# EAGLE design New_Multirotor_CPU_imu (EAGLE 6.3)
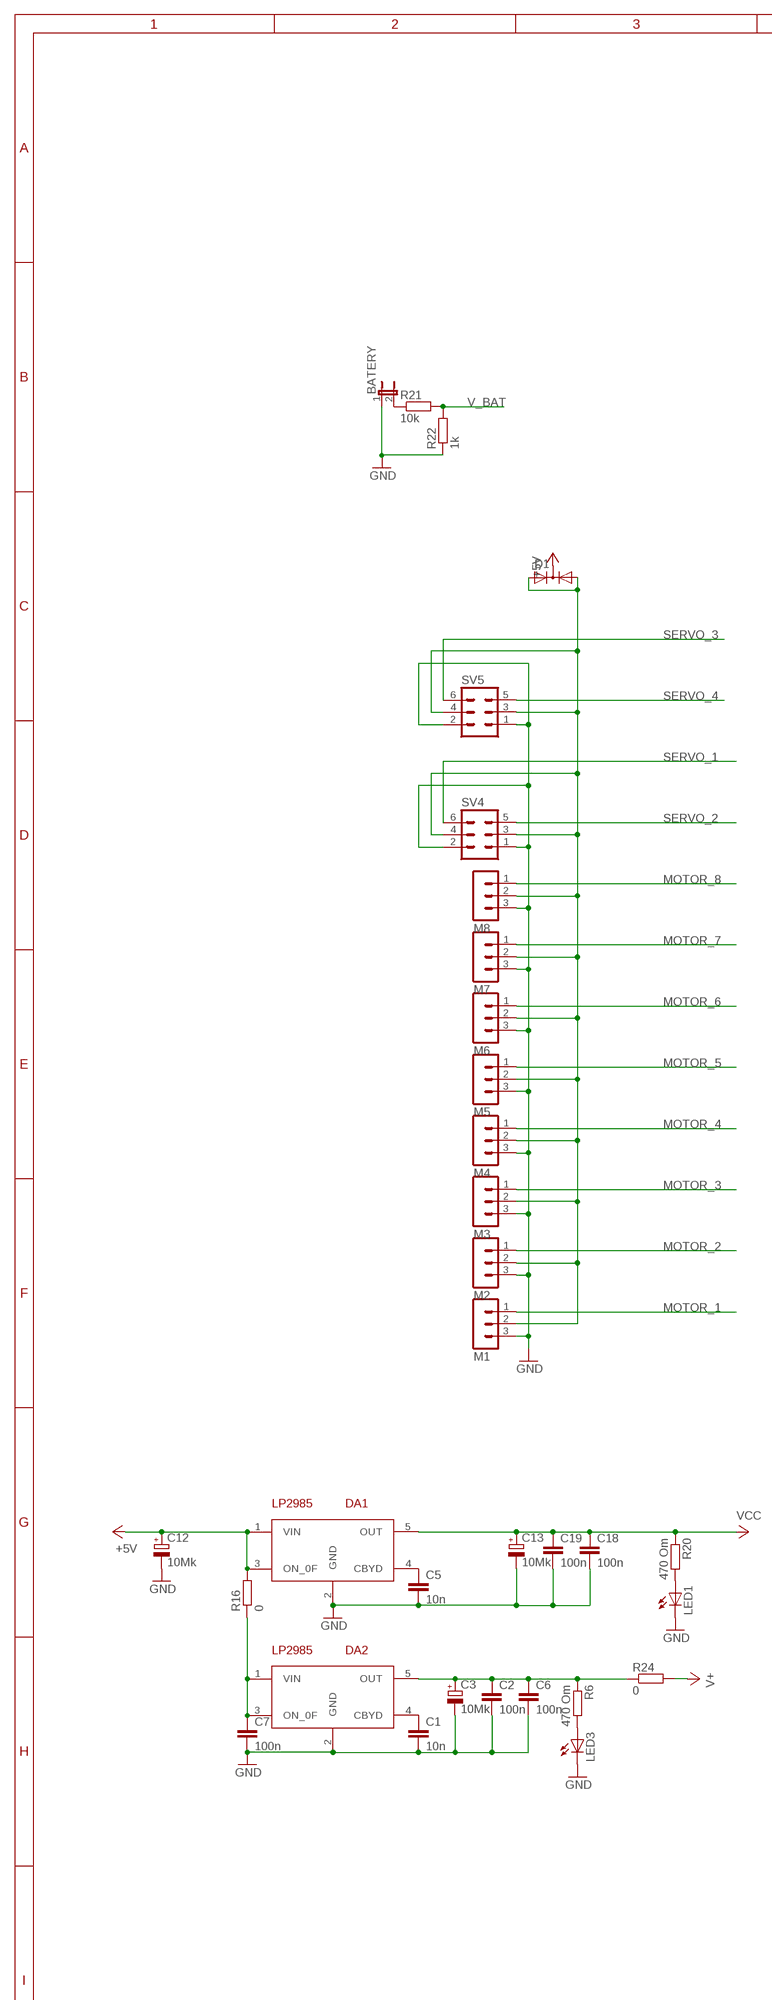
[diagram p0: schematic, sheet 1, part 1 of 2]
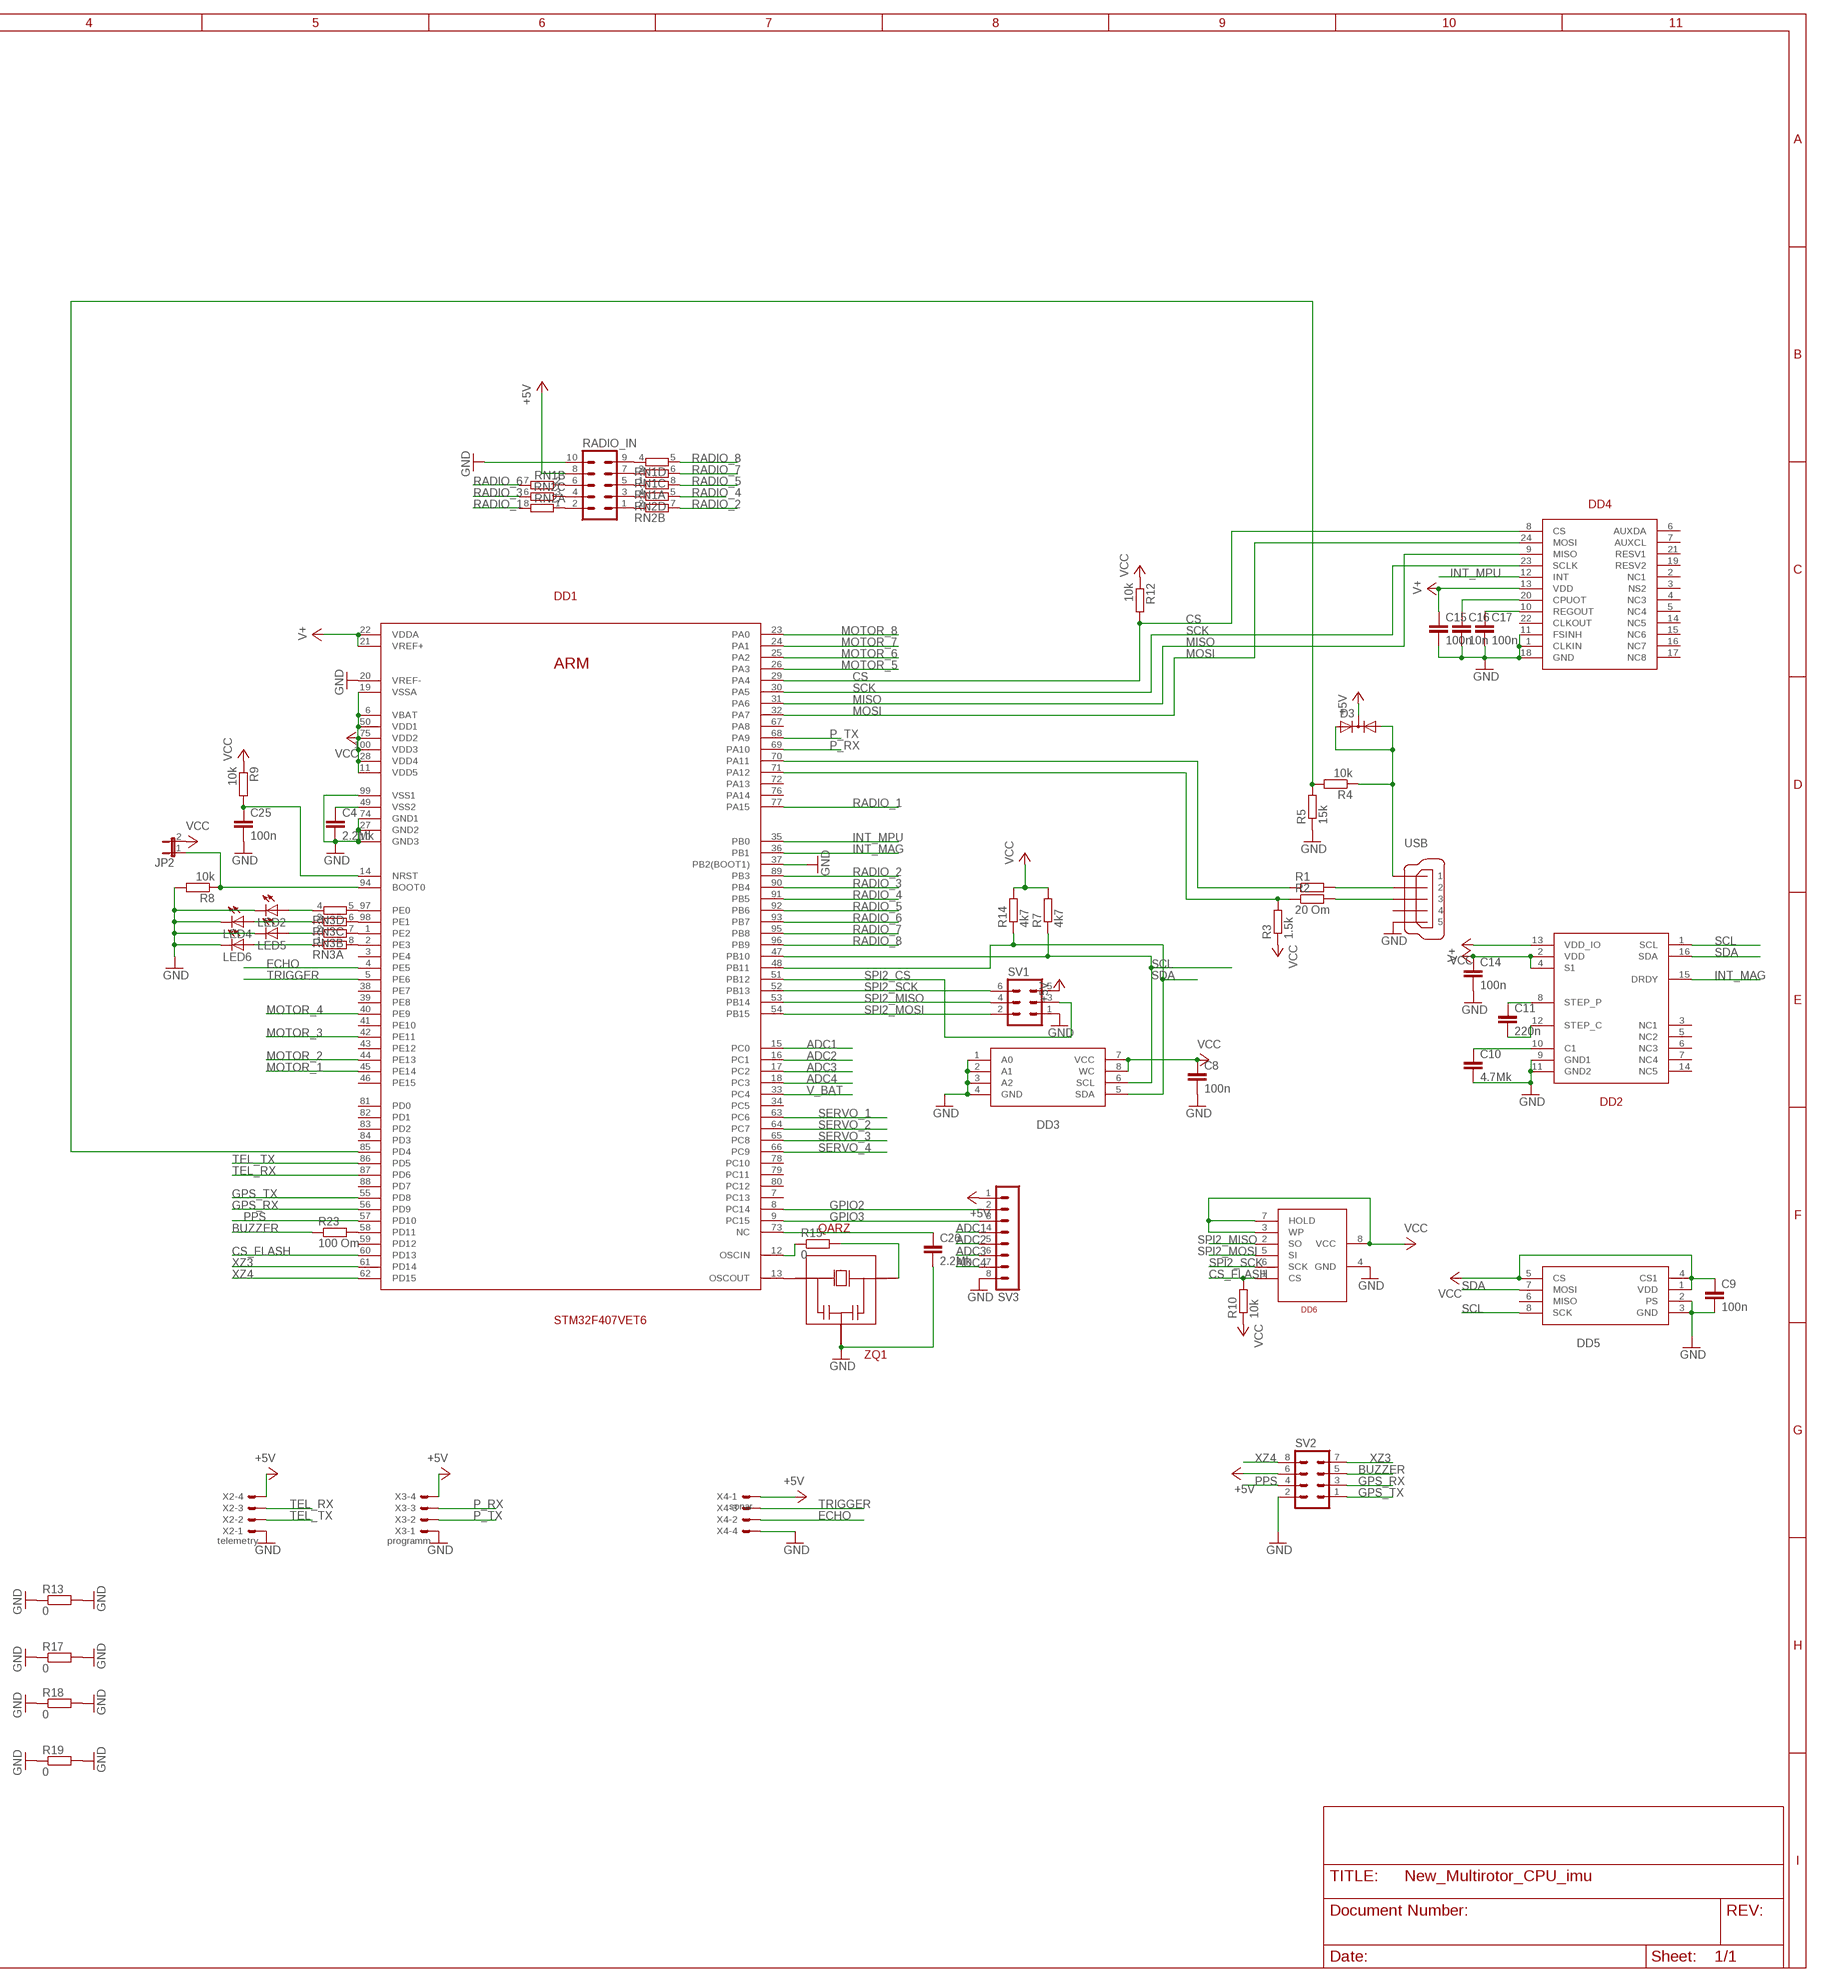
[diagram p1: schematic, sheet 1, part 2 of 2]

## Parts
BATERY  JP1E  [JP1]
C1  10n  C-EUC0603K  [C0603K]
C2  100n  C-EUC0603K  [C0603K]
C3  10Mk  CPOL-EUA/3216-18W  [A/3216-18W]
C4  2.2Mk  C-EUC0603K  [C0603K]
C5  10n  C-EUC0603K  [C0603K]
C6  100n  C-EUC0603K  [C0603K]
C7  100n  C-EUC0603K  [C0603K]
C8  100n  C-EUC0603K  [C0603K]
C9  100n  C-EUC0603K  [C0603K]
C10  4.7Mk  C-EUC0603K  [C0603K]
C11  220n  C-EUC0603K  [C0603K]
C12  10Mk  CPOL-EUA/3216-18W  [A/3216-18W]
C13  10Mk  CPOL-EUA/3216-18W  [A/3216-18W]
C14  100n  C-EUC0603K  [C0603K]
C15  100n  C-EUC0603K  [C0603K]
C16  10n  C-EUC0603K  [C0603K]
C17  100n  C-EUC0603K  [C0603K]
C18  100n  C-EUC0603K  [C0603K]
C19  100n  C-EUC0603K  [C0603K]
C25  100n  C-EUC0603K  [C0603K]
C26  2.2Mk  C-EUC0603K  [C0603K]
D1  DIODE-2AC|CASOT23  [SOT23]
D3  DIODE-2AC|CASOT23  [SOT23]
DA1  LP2985  3.3  [SOT23-5L]
DA2  LP2985  3.3  [SOT23-5L]
DD1  STM32F407VET6  [LQFP100]
DD2  HMC5883L  [LCC-16]
DD3  24C512  [SOIC8]
DD4  MPU6000  [JEDEC]
DD5  MS5611-01BA03  [MS5611-01BA03]
DD6  W25X40  [SOIC8]
JP2  JP1E  [JP1]
LED1  LEDCHIPLED_0603  [CHIPLED_0603]
LED2  LEDCHIPLED_0603  [CHIPLED_0603]
LED3  LEDCHIPLED_0603  [CHIPLED_0603]
LED4  LEDCHIPLED_0603  [CHIPLED_0603]
LED5  LEDCHIPLED_0603  [CHIPLED_0603]
LED6  LEDCHIPLED_0603  [CHIPLED_0603]
M1  MA03-1  [MA03-1]
M2  MA03-1  [MA03-1]
M3  MA03-1  [MA03-1]
M4  MA03-1  [MA03-1]
M5  MA03-1  [MA03-1]
M6  MA03-1  [MA03-1]
M7  MA03-1  [MA03-1]
M8  MA03-1  [MA03-1]
R1  R-EU_R0603  [R0603]
R2  20 Om  R-EU_R0603  [R0603]
R3  1.5k  R-EU_R0603  [R0603]
R4  10k  R-EU_R0603  [R0603]
R5  15k  R-EU_R0603  [R0603]
R6  470 Om  R-EU_R0603  [R0603]
R7  4k7  R-EU_R0603  [R0603]
R8  10k  R-EU_R0603  [R0603]
R9  10k  R-EU_R0603  [R0603]
R10  10k  R-EU_R0603  [R0603]
R12  10k  R-EU_R0603  [R0603]
R13  0  R-EU_R0603  [R0603]
R14  4k7  R-EU_R0603  [R0603]
R15  0  R-EU_R0603  [R0603]
R16  0  R-EU_R0603  [R0603]
R17  0  R-EU_R0603  [R0603]
R18  0  R-EU_R0603  [R0603]
R19  0  R-EU_R0603  [R0603]
R20  470 Om  R-EU_R0603  [R0603]
R21  10k  R-EU_R0603  [R0603]
R22  1k  R-EU_R0603  [R0603]
R23  100 Om  R-EU_R0603  [R0603]
R24  0  R-EU_R0603  [R0603]
RADIO_IN  MA05-2  [MA05-2]
RN1  4R-N0603-ARV  [0603-ARV]
RN2  4R-N0603-ARV  [0603-ARV]
RN3  4R-N0603-ARV  [0603-ARV]
SV1  MA03-2  [MA03-2]
SV2  MA04-2  [MA04-2]
SV3  MA08-1  [MA08-1]
SV4  MA03-2  [MA03-2]
SV5  MA03-2  [MA03-2]
USB  MINI-USB-32005-201  [32005-201]
X2  telemetry  SM04B-SRSS-TB  [SM04B-SRSS-TB]
X3  programm  SM04B-SRSS-TB  [SM04B-SRSS-TB]
X4  sonar  SM04B-SRSS-TB  [SM04B-SRSS-TB]
ZQ1  QARZ  [QARZ]

## Nets
+5V: C12.+ D1.3(C) D3.3(C) DA1.1(VIN) DA1.3(ON_0F) R16.2 RADIO_IN.8 SV1.5 SV2.6 SV3.1 X2.4 X3.4 X4.1
ADC1: DD1.15(PC0) SV3.4
ADC2: DD1.16(PC1) SV3.5
ADC3: DD1.17(PC2) SV3.6
ADC4: DD1.18(PC3) SV3.7
BUZZER: R23.1 SV2.5
CS: DD1.29(PA4) DD4.8(CS) R12.2
CS_FLASH: DD1.60(PD13) DD6.1(CS) R10.2
ECHO: DD1.4(PE5) X4.2
GND: BATERY.1 C1.2 C2.2 C3.- C4.2 C5.2 C6.2 C7.2 C8.2 C9.2 C10.2 C12.- C13.- C14.2 C15.2 C16.2 C17.2 C18.2 C19.2 C25.2 C26.2 DA1.2(GND) DA2.2(GND) DD1.10(GND3) DD1.20(VREF-) DD1.27(GND2) DD1.37(PB2(BOOT1)) DD1.74(GND1) DD1.99(VSS1) DD2.9(GND1) DD2.11(GND2) DD3.1(A0) DD3.2(A1) DD3.3(A2) DD3.4(GND) DD4.1(CLKIN) DD4.11(FSINH) DD4.18(GND) DD5.2(PS) DD5.3(GND) DD6.4(GND) LED1.C LED2.C LED3.C LED4.C LED5.C LED6.C M1.3 M2.3 M3.3 M4.3 M5.3 M6.3 M7.3 M8.3 R5.1 R8.2 R13.1 R13.2 R17.1 R17.2 R18.1 R18.2 R19.1 R19.2 R22.1 RADIO_IN.10 SV1.1 SV2.2 SV3.8 SV4.1 SV4.2 SV5.1 SV5.2 USB.5 X2.1 X3.1 X4.4 ZQ1.2
GPIO2: DD1.8(PC14) SV3.2
GPIO3: DD1.9(PC15) SV3.3
GPS_RX: DD1.56(PD9) SV2.3
GPS_TX: DD1.55(PD8) SV2.1
INT_MAG: DD1.36(PB1) DD2.15(DRDY)
INT_MPU: DD1.35(PB0) DD4.12(INT)
MISO: DD1.31(PA6) DD4.9(MISO)
MOSI: DD1.32(PA7) DD4.24(MOSI)
MOTOR_1: DD1.45(PE14) M1.1
MOTOR_2: DD1.44(PE13) M2.1
MOTOR_3: DD1.42(PE11) M3.1
MOTOR_4: DD1.40(PE9) M4.1
MOTOR_5: DD1.26(PA3) M5.1
MOTOR_6: DD1.25(PA2) M6.1
MOTOR_7: DD1.24(PA1) M7.1
MOTOR_8: DD1.23(PA0) M8.1
N$1: DD1.13(OSCOUT) ZQ1.1
N$2: R15.2 ZQ1.3
N$3: DD1.97(PE0) RN3.5
N$4: C1.1 DA2.4(CBYD)
N$5: DD1.98(PE1) RN3.6
N$6: LED3.A R6.2
N$7: C2.1 C3.+ C6.1 DA2.5(OUT) R6.1 R24.1
N$8: RADIO_IN.5 RN1.1
N$9: C7.1 DA2.1(VIN) DA2.3(ON_0F) R16.1
N$10: DD1.1(PE2) RN3.7
N$11: DD1.2(PE3) RN3.8
N$12: DD1.12(OSCIN) R15.1
N$13: LED1.A R20.2
N$16: LED2.A RN3.4
N$17: LED4.A RN3.3
N$19: C16.1 DD4.20(CPUOT)
N$20: D1.1(A1) D1.2(A2) M1.2 M2.2 M3.2 M4.2 M5.2 M6.2 M7.2 M8.2 SV4.3 SV4.4 SV5.3 SV5.4
N$21: RADIO_IN.3 RN2.4
N$22: C17.1 DD4.10(REGOUT)
N$23: RADIO_IN.9 RN1.4
N$24: RADIO_IN.7 RN1.3
N$25: BATERY.2 R21.1
N$26: C10.1 DD2.10(C1)
N$27: C11.2 DD2.12(STEP_C)
N$28: C11.1 DD2.8(STEP_P)
N$29: DD1.58(PD11) R23.2
N$32: RADIO_IN.6 RN1.2
N$33: RADIO_IN.1 RN2.2
N$34: RADIO_IN.4 RN2.3
N$35: RADIO_IN.2 RN2.1
N$38: LED5.A RN3.2
N$39: LED6.A RN3.1
N$41: DD1.70(PA11) R1.1
N$42: DD1.71(PA12) R2.1 R3.2
N$43: R1.2 USB.2
N$44: R2.2 USB.3
N$45: DD1.85(PD4) R4.2 R5.2
N$47: D3.1(A1) D3.2(A2) R4.1 USB.1
N$52: C5.1 DA1.4(CBYD)
N$53: C4.1 DD1.49(VSS2)
N$61: DD1.94(BOOT0) JP2.1 R8.1
N$66: C25.1 DD1.14(NRST) R9.2
N$77: C26.1 DD1.73(NC)
P_RX: DD1.69(PA10) X3.3
P_TX: DD1.68(PA9) X3.2
PPS: DD1.57(PD10) SV2.4
RADIO_1: DD1.77(PA15) RN2.8
RADIO_2: DD1.89(PB3) RN2.7
RADIO_3: DD1.90(PB4) RN2.6
RADIO_4: DD1.91(PB5) RN2.5
RADIO_5: DD1.92(PB6) RN1.8
RADIO_6: DD1.93(PB7) RN1.7
RADIO_7: DD1.95(PB8) RN1.6
RADIO_8: DD1.96(PB9) RN1.5
SCK: DD1.30(PA5) DD4.23(SCLK)
SCL: DD1.47(PB10) DD2.1(SCL) DD3.6(SCL) DD5.8(SCK) R7.1
SDA: DD1.48(PB11) DD2.16(SDA) DD3.5(SDA) DD5.7(MOSI) R14.1
SERVO_1: DD1.63(PC6) SV4.6
SERVO_2: DD1.64(PC7) SV4.5
SERVO_3: DD1.65(PC8) SV5.6
SERVO_4: DD1.66(PC9) SV5.5
SPI2_CS: DD1.51(PB12) SV1.3
SPI2_MISO: DD1.53(PB14) DD6.2(SO) SV1.4
SPI2_MOSI: DD1.54(PB15) DD6.5(SI) SV1.2
SPI2_SCK: DD1.52(PB13) DD6.6(SCK) SV1.6
TEL_RX: DD1.87(PD6) X2.3
TEL_TX: DD1.86(PD5) X2.2
TRIGGER: DD1.5(PE6) X4.3
V+: C14.1 C15.1 DD1.21(VREF+) DD1.22(VDDA) DD2.2(VDD) DD2.4(S1) DD4.13(VDD) R24.2
V_BAT: DD1.33(PC4) R21.2 R22.2
VCC: C8.1 C9.1 C13.+ C18.1 C19.1 DA1.5(OUT) DD1.6(VBAT) DD1.11(VDD5) DD1.19(VSSA) DD1.28(VDD4) DD1.50(VDD1) DD1.75(VDD2) DD1.100(VDD3) DD2.13(VDD_IO) DD3.7(VCC) DD3.8(WC) DD5.1(VDD) DD5.4(CS1) DD5.5(CS) DD6.3(WP) DD6.7(HOLD) DD6.8(VCC) JP2.2 R3.1 R7.2 R9.1 R10.1 R12.1 R14.2 R20.1
XZ3: DD1.61(PD14) SV2.7
XZ4: DD1.62(PD15) SV2.8
Unconnected: DD1.3(PE4) DD1.7(PC13) DD1.34(PC5) DD1.38(PE7) DD1.39(PE8) DD1.41(PE10) DD1.43(PE12) DD1.46(PE15) DD1.59(PD12) DD1.67(PA8) DD1.72(PA13) DD1.76(PA14) DD1.78(PC10) DD1.79(PC11) DD1.80(PC12) DD1.81(PD0) DD1.82(PD1) DD1.83(PD2) DD1.84(PD3) DD1.88(PD7) DD2.3(NC1) DD2.5(NC2) DD2.6(NC3) DD2.7(NC4) DD2.14(NC5) DD4.2(NC1) DD4.3(NS2) DD4.4(NC3) DD4.5(NC4) DD4.6(AUXDA) DD4.7(AUXCL) DD4.14(NC5) DD4.15(NC6) DD4.16(NC7) DD4.17(NC8) DD4.19(RESV2) DD4.21(RESV1) DD4.22(CLKOUT) DD5.6(MISO) USB.4

## Library data of the parts
BATERY JP2 = jumper:JP1E: JUMPER
C1 C2 C4-C11 C14-C19 C25 C26 = resistor:C-EU: CAPACITOR, European symbol
C3 C12 C13 = resistor:CPOL-EU: POLARIZED CAPACITOR, European symbol
D1 D3 = diode:DIODE-2AC|CA: Dual DIODE Anode-Cathode|Cathode-Anode
DA1 DA2 = pepelac:3.3
DD1 = pepelac:STM32F407VET6
DD2 = pepelac:HMC5883L
DD3 = pepelac:24C512
DD4 = pepelac:MPU6000
DD5 = pepelac:MS5611-01BA03
DD6 = pepelac:W25X40
LED1-LED6 = led:LED: LED OSRAM: - CHIPLED LG R971, LG N971, LY N971, LG Q971, LY Q971, LO R971, LY R971 LH N974, LH R974 LS Q976, LO Q976, LY Q976 LO Q996 - Hyper CHIPLED LW Q18S LB Q993, LB Q99A, LB R99A - SideLED LS A670, LO A670, LY A670, LG A670, LP A670 LB A673, LV A673, LT A673, LW A673 LH A674 LY A675 LS A676, LA A676, LO A676, LY A676, LW A676 LS A679, LY A679, LG A679 - Hyper Micro SIDELED® LS Y876, LA Y876, LO Y876, LY Y876 LT Y87S - SmartLED LW L88C, LW L88S LB L89C, LB L89S, LG L890 LS L89K, LO L89K, LY L89K LS L896, LA L896, LO L896, LY L896 - TOPLED LS T670, LO T670, LY T670, LG T670, LP T670 LSG T670, LSP T670, LSY T670, LOP T670, LYG T670 LG T671, LOG T671, LSG T671 LB T673, LV T673, LT T673, LW T673 LH T674 LS T676, LA T676, LO T676, LY T676, LB T676, LH T676, LSB T676, LW T676 LB T67C, LV T67C, LT T67C, LS T67K, LO T67K, LY T67K, LW E67C LS E67B, LA E67B, LO E67B, LY E67B, LB E67C, LV E67C, LT E67C LW T67C LS T679, LY T679, LG T679 LS T770, LO T770, LY T770, LG T770, LP T770 LB T773, LV T773, LT T773, LW T773 LH T774 LS E675, LA E675, LY E675, LS T675 LS T776, LA T776, LO T776, LY T776, LB T776 LHGB T686 LT T68C, LB T68C - Hyper Mini TOPLED® LB M676 - Mini TOPLED Santana® LG M470 LS M47K, LO M47K, LY M47K Source: http://www.osram.convergy.de LUXEON: - LUMILED® LXK2-PW12-R00, LXK2-PW12-S00, LXK2-PW14-U00, LXK2-PW14-V00 LXK2-PM12-R00, LXK2-PM12-S00, LXK2-PM14-U00 LXK2-PE12-Q00, LXK2-PE12-R00, LXK2-PE12-S00, LXK2-PE14-T00, LXK2-PE14-U00 LXK2-PB12-K00, LXK2-PB12-L00, LXK2-PB12-M00, LXK2-PB14-N00, LXK2-PB14-P00, LXK2-PB14-Q00 LXK2-PR12-L00, LXK2-PR12-M00, LXK2-PR14-Q00, LXK2-PR14-R00 LXK2-PD12-Q00, LXK2-PD12-R00, LXK2-PD12-S00 LXK2-PH12-R00, LXK2-PH12-S00 LXK2-PL12-P00, LXK2-PL12-Q00, LXK2-PL12-R00 Source: www.luxeon.com KINGBRIGHT: KA-3528ASYC Source: www.kingbright.com
M1-M8 = con-lstb:MA03-1: PIN HEADER; OC_FARNELL: unknown; OC_NEWARK: unknown
R1-R10 R12-R24 = resistor:R-EU_: RESISTOR, European symbol
RADIO_IN = con-lstb:MA05-2: PIN HEADER; OC_FARNELL: unknown; OC_NEWARK: unknown
RN1-RN3 = resistor-dil:4R-N: Array Chip Resistor Source: RS Component / Phycomp; OC_FARNELL: unknown; OC_NEWARK: unknown
SV1 SV4 SV5 = con-lstb:MA03-2: PIN HEADER; OC_FARNELL: unknown; OC_NEWARK: unknown
SV2 = con-lstb:MA04-2: PIN HEADER; OC_FARNELL: unknown; OC_NEWARK: unknown
SV3 = con-lstb:MA08-1: PIN HEADER; OC_FARNELL: unknown; OC_NEWARK: unknown
USB = con-cypressindustries:MINI-USB-: MINI USB-B Conector Source: www.cypressindustries.com; OC_FARNELL: unknown; OC_NEWARK: unknown
X2-X4 = pepelac:?M04B-SRSS-TB: Disconnectable Crimp style connector, 1.0mm pitch 4 contacts
ZQ1 = pepelac:QARZ

## Net classes
0 Def: width 0.406 mm, clearance 0.152 mm

## Board
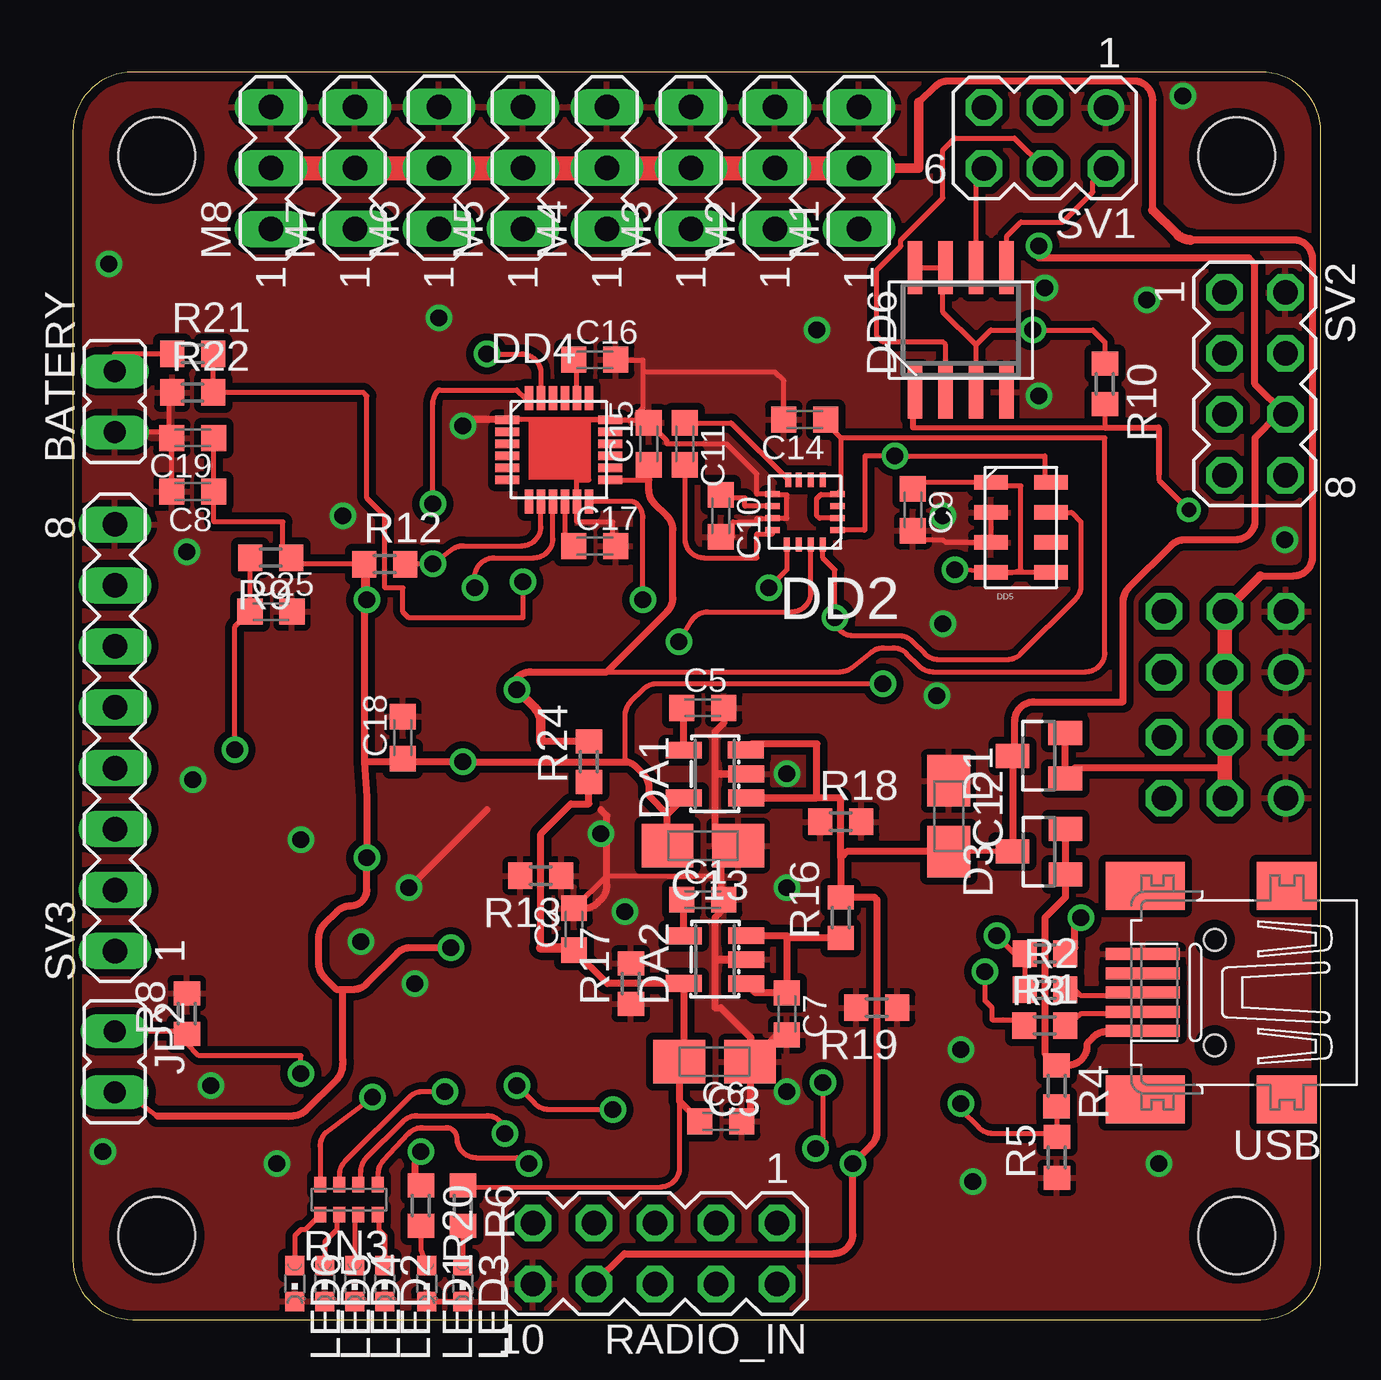
[diagram p2: board, top side]
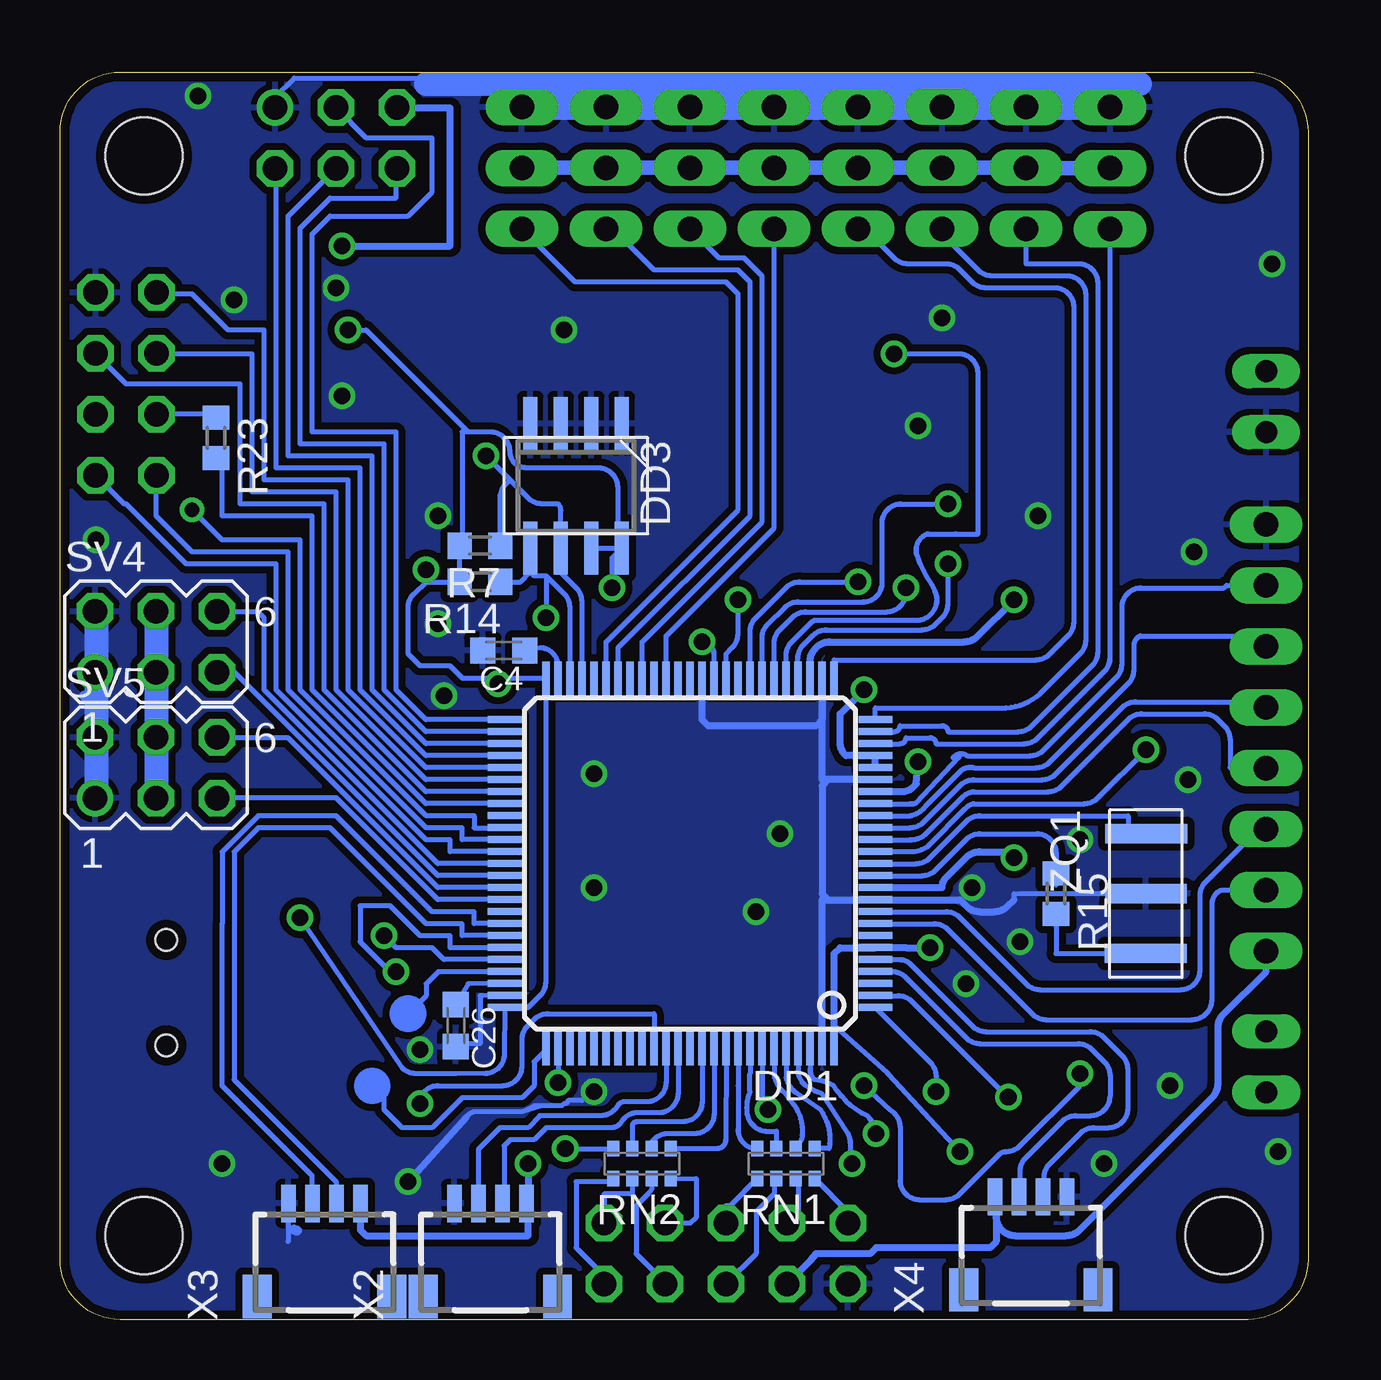
[diagram p3: board, bottom side, seen from below]

Size 52 x 52 mm. Coordinates in mm from the lower left corner, seen from the top.
Outline: 0,49.5 0,2.5 arc90 2.5,0 49.5,0 arc90 52,2.5 52,49.5 arc90 49.5,52 2.5,52 arc90 0,49.5
Copper layers (1*16): Top 0.035mm / dielectric 1.5mm / Bottom 0.035mm
Design rules "default *": minimum track width 10mil, minimum drill 24mil, track to track 8mil, track to pad 8mil, pad to pad 8mil, via to via 8mil, smd to smd 8mil, copper to edge 15mil, drill to drill 8mil, minimum pad ring 10mil, minimum via ring 8mil, stop-mask expansion 4mil, vias tented up to drill 0mil, thermal gap 10mil
Holes 3.2 mm at 3.5,3.5 48.5,3.5 48.5,48.5 3.5,48.5

### Footprints (pad centres in the part's own frame; a part is rotated, then mirrored left to right if it is on the bottom)
JP1 = drill 0.914 long: 1 0,-1.27; 2 0,1.27
C0603K = smd 1.05 x 1.08: 1 -0.875,0; 2 0.875,0
A/3216-18W = smd 2.15 x 1.8: + 1.475,0; - -1.475,0
SOT23 = smd 1 x 1.4: 1 -0.95,-1.1; 2 0.95,-1.1; 3 0,1.1
SOT23-5L = smd 0.7 x 1.5: 1 -1.002,-1.305; 2 0,-1.3; 3 0.997,-1.294; 4 0.991,1.3; 5 -0.998,1.293
LQFP100 = smd 1.4 x 0.3: 1 -7.72,6; 2 -7.72,5.5; 3 -7.72,5; 4 -7.72,4.5; 5 -7.72,4; 6 -7.72,3.5; 7 -7.72,3; 8 -7.72,2.5; 9 -7.72,2; 10 -7.72,1.5; 11 -7.72,1; 12 -7.72,0.5; 13 -7.72,0; 14 -7.72,-0.5; 15 -7.72,-1; 16 -7.72,-1.5; 17 -7.72,-2; 18 -7.72,-2.5; 19 -7.72,-3; 20 -7.72,-3.5; 21 -7.72,-4; 22 -7.72,-4.5; 23 -7.72,-5; 24 -7.72,-5.5; 25 -7.72,-6; 51 7.72,-6; 52 7.72,-5.5; 53 7.72,-5; 54 7.72,-4.5; 55 7.72,-4; 56 7.72,-3.5; 57 7.72,-3; 58 7.72,-2.5; 59 7.72,-2; 60 7.72,-1.5; 61 7.72,-1; 62 7.72,-0.5; 63 7.72,0; 64 7.72,0.5; 65 7.72,1; 66 7.72,1.5; 67 7.72,2; 68 7.72,2.5; 69 7.72,3; 70 7.72,3.5; 71 7.72,4; 72 7.72,4.5; 73 7.72,5; 74 7.72,5.5; 75 7.72,6 | smd 0.3 x 1.4: 26 -6,-7.72; 27 -5.5,-7.72; 28 -5,-7.72; 29 -4.5,-7.72; 30 -4,-7.72; 31 -3.5,-7.72; 32 -3,-7.72; 33 -2.5,-7.72; 34 -2,-7.72; 35 -1.5,-7.72; 36 -1,-7.72; 37 -0.5,-7.72; 38 0,-7.72; 39 0.5,-7.72; 40 1,-7.72; 41 1.5,-7.72; 42 2,-7.72; 43 2.5,-7.72; 44 3,-7.72; 45 3.5,-7.72; 46 4,-7.72; 47 4.5,-7.72; 48 5,-7.72; 49 5.5,-7.72; 50 6,-7.72; 76 6,7.72; 77 5.5,7.72; 78 5,7.72; 79 4.5,7.72; 80 4,7.72; 81 3.5,7.72; 82 3,7.72; 83 2.5,7.72; 84 2,7.72; 85 1.5,7.72; 86 1,7.72; 87 0.5,7.72; 88 0,7.72; 89 -0.5,7.72; 90 -1,7.72; 91 -1.5,7.72; 92 -2,7.72; 93 -2.5,7.72; 94 -3,7.72; 95 -3.5,7.72; 96 -4,7.72; 97 -4.5,7.72; 98 -5,7.72; 99 -5.5,7.72; 100 -6,7.72
LCC-16 = smd 0.6 x 0.25: 1 -1.35,0.85; 2 -1.35,0.35; 3 -1.35,-0.15; 4 -1.35,-0.65; 9 1.35,-0.65; 10 1.35,-0.15; 11 1.35,0.35; 12 1.35,0.85 | smd 0.25 x 0.6: 5 -0.75,-1.25; 6 -0.25,-1.25; 7 0.25,-1.25; 8 0.7,-1.25; 13 0.75,1.45; 14 0.25,1.45; 15 -0.25,1.45; 16 -0.75,1.45
SOIC8 = smd 0.6 x 2.2: 1 -1.905,-2.6; 2 -0.635,-2.6; 3 0.635,-2.6; 4 1.905,-2.6; 5 1.905,2.6; 6 0.635,2.6; 7 -0.635,2.6; 8 -1.905,2.6
JEDEC = smd 1 x 0.35: 1 -2.15,1.25; 2 -2.15,0.75; 3 -2.15,0.25; 4 -2.15,-0.25; 5 -2.15,-0.75; 6 -2.15,-1.25; 13 2.15,-1.25; 14 2.15,-0.75; 15 2.15,-0.25; 16 2.15,0.25; 17 2.15,0.75; 18 2.15,1.25 | smd 0.35 x 1: 7 -1.25,-2.15; 8 -0.75,-2.15; 9 -0.25,-2.15; 10 0.25,-2.15; 11 0.75,-2.15; 12 1.25,-2.15; 19 1.25,2.15; 20 0.75,2.15; 21 0.25,2.15; 22 -0.25,2.15; 23 -0.75,2.15; 24 -1.25,2.15
MS5611-01BA03 = smd 1.4 x 0.6: 1 -1.25,1.875; 2 -1.25,0.625; 3 -1.25,-0.625; 4 -1.25,-1.875; 5 1.25,-1.875; 6 1.25,-0.625; 7 1.25,0.625; 8 1.25,1.875
CHIPLED_0603 = smd 0.8 x 0.8: A 0,-0.75; C 0,0.75
MA03-1 = drill 1.016 long: 1 -2.54,0; 2 0,0; 3 2.54,0
R0603 = smd 1 x 1.1: 1 -0.85,0; 2 0.85,0
MA05-2 = drill 1.016 octagon: 1 -5.08,-1.27; 2 -5.08,1.27; 3 -2.54,-1.27; 4 -2.54,1.27; 5 0,-1.27; 6 0,1.27; 7 2.54,-1.27; 8 2.54,1.27; 9 5.08,-1.27; 10 5.08,1.27
0603-ARV = smd 0.5 x 0.65: 1 -1.2,-0.625; 2 -0.4,-0.625; 3 0.4,-0.625; 4 1.2,-0.625; 5 1.2,0.625; 6 0.4,0.625; 7 -0.4,0.625; 8 -1.2,0.625
MA03-2 = drill 1.016: 1 -2.54,-1.27 | drill 1.016 octagon: 2 -2.54,1.27; 3 0,-1.27; 4 0,1.27; 5 2.54,-1.27; 6 2.54,1.27
MA04-2 = drill 1.016 octagon: 1 -3.81,-1.27; 2 -3.81,1.27; 3 -1.27,-1.27; 4 -1.27,1.27; 5 1.27,-1.27; 6 1.27,1.27; 7 3.81,-1.27; 8 3.81,1.27
MA08-1 = drill 1.016 long: 1 -8.89,0; 2 -6.35,0; 3 -3.81,0; 4 -1.27,0; 5 1.27,0; 6 3.81,0; 7 6.35,0; 8 8.89,0
32005-201 = smd 3.1 x 0.5: 1 3,1.6; 2 3,0.8; 3 3,0; 4 3,-0.8; 5 3,-1.6 | smd 2.5 x 2: M1 -3,-4.45; M2 -3,4.45 | smd 3.3 x 2: M3 2.9,4.45; M4 2.9,-4.45 | hole 0.9: 0,2.2; 0,-2.2
SM04B-SRSS-TB = smd 0.6 x 1.55: 1 -1.5,2.975; 2 -0.5,2.975; 3 0.5,2.975; 4 1.5,2.975 | smd 1.2 x 1.8: FIT@1 -2.8,-0.9; FIT@2 2.8,-0.9
QARZ = smd 0.8 x 3.4: 1 -2.495,0.01; 2 0,0; 3 2.49,-0.01

### Placement (x,y rotation side)
BATERY  1.74,38.25 0 top
C1  26.25,17.5 0 top
C2  20.88,16.27 90 top
C3  26.74,10.75 180 top
C4  33.51,27.88 180 bottom
C5  26.25,25.5 0 top
C6  27,8.25 0 top
C7  29.75,12.75 270 top
C8  5,34.51 180 top
C9  35,33.75 270 top
C10  27,33.5 270 top
C11  25.5,36.5 270 top
C12  36.49,20.98 270 top
C13  26.25,19.75 180 top
C14  30.5,37.51 180 top
C15  24,36.5 90 top
C16  21.75,40 0 top
C17  21.75,32.24 0 top
C18  13.75,24.25 90 top
C19  5,36.75 180 top
C25  8.25,29.5 0 top
C26  35.5,12.25 270 bottom
D1  40.25,23.5 90 top
D3  40.25,19.5 90 top
DA1  26.75,22.74 90 top
DA2  26.75,15 90 top
DD1  25.75,19 180 bottom
DD2  30.5,33.75 180 top
DD3  30.5,34.75 180 bottom
DD4  20.25,36.25 0 top
DD5  39.5,33.01 0 top
DD6  37,41.25 0 top
JP2  1.74,10.74 180 top
LED1  14.75,1.5 180 top
LED2  13,1.5 180 top
LED3  16.25,1.5 180 top
LED4  11.75,1.5 180 top
LED5  10.5,1.5 180 top
LED6  9.25,1.5 180 top
M1  32.75,48 90 top
M2  29.25,48 90 top
M3  25.75,48 90 top
M4  22.25,48 90 top
M5  18.75,48 90 top
M6  15.25,48 90 top
M7  11.75,48 90 top
M8  8.25,48 90 top
R1  40.5,12.25 0 top
R2  40.5,13.75 0 top
R3  40.5,15.25 180 top
R4  40.99,9.74 270 top
R5  41,6.77 90 top
R6  16.25,4.75 270 top
R7  34.5,32.25 180 bottom
R8  4.75,12.75 90 top
R9  8.25,31.75 180 top
R10  43,39 270 top
R12  13,31.49 0 top
R13  19.5,18.5 180 top
R14  34.5,30.75 180 bottom
R15  10.5,17.75 270 bottom
R16  31.99,16.75 90 top
R17  23.25,14 90 top
R18  32,20.75 0 top
R19  33.5,13 180 top
R20  14.5,4.75 270 top
R21  5,40.25 0 top
R22  4.99,38.64 0 top
R23  45.5,36.75 270 bottom
R24  21.5,23.25 90 top
RADIO_IN  24.25,2.75 180 top
RN1  21.75,6.5 0 bottom
RN2  27.75,6.5 0 bottom
RN3  11.5,5 0 top
SV1  40.5,49.25 180 top
SV2  49.25,39 270 top
SV3  1.75,24.25 90 top
SV4  48,28.25 0 bottom
SV5  48,23 0 bottom
USB  47.58,13.63 180 top
X2  34.07,1.86 0 bottom
X3  40.98,1.86 0 bottom
X4  11.55,2.14 0 bottom
ZQ1  6.75,17.75 270 bottom

### Tracks (layer width: path | path; a pad name or v marks a point on that pad's centre or on a via)
+5V  (via drill 0.7)
  Top 0.2: D3.3 C12.+ | C12.+
  Top 0.3: D3.3 D1.3 39.25,23.6 39.25,24.95 arc-90 40.05,25.75 43.75,25.75 43.75,29.92 arc-45 43.98,30.48 45.77,32.27 arc-45 46.33,32.5 48.45,32.5 arc90 49.25,33.3 49.25,36.75 50.23,37.73 SV2.6 49.25,39 49.25,44 49,44.25 40.25,44.25 v40.25,44.75 | C12.+ 32.25,19.5 32,19.25 | 32,19.25 R16.2 | R16.2 | 32,19.25 32,21.75 31,21.75 | 31,21.75 28.07,21.75 DA1.1 30.24,21.74 31,21.75 | 31,21.75 31,24 28.31,24 DA1.3 | R16.2 33.39,17.61 33.5,17.5 33.5,7.83 arc-45 33.27,7.27 v32.5,6.5 32.5,3.55 arc-90 31.7,2.75 22.98,2.75 RADIO_IN.8
  Bottom 0.3: v32.5,6.5 32.5,4.91 X2.4 32.5,4.76 32.5,3.5 39.25,3.5 39.48,3.73 X3.4 | X4.1 13,5.07 13,4.3 | 13,4.3 arc-90 12.2,3.5 10.08,3.5 arc-45 9.52,3.73 3.98,9.27 arc-45 3.75,9.83 3.75,12.17 arc45 3.52,12.73 1.75,14.5 SV3.1 | v40.25,44.75 35.75,44.75 35.75,50.5 37.94,50.5 SV1.5 | 13,4.3 13,3.25 13.25,3 18,3 18.25,2.75 20.5,2.75 20.75,2.44 RADIO_IN.8
ADC1
  Bottom 0.2: DD1.15 16.58,20 arc-45 15.96,20.21 14.43,21.74 arc45 13.92,22 10.83,22 arc-45 10.27,22.23 7.48,25.02 arc45 6.92,25.25 4.33,25.25 arc45 3.77,25.02 3.48,24.73 arc45 3.25,24.17 3.25,23.03 arc-45 3.23,22.98 SV3.4
ADC2
  Bottom 0.2: DD1.16 16.58,20.5 arc-45 16.02,20.73 14.48,22.27 arc45 13.92,22.5 11.08,22.5 arc-45 10.52,22.73 7.73,25.52 arc45 7.17,25.75 2.5,25.75 2.27,25.52 SV3.5
ADC3
  Bottom 0.2: DD1.17 16.58,21 arc-45 15.93,21.4 14.4,22.93 arc45 13.92,23 11.33,23 arc-45 10.77,23.23 7.48,26.52 arc-45 7.25,27.08 7.25,28.17 arc45 7.02,28.48 arc45 6.98,28.5 3,28.5 2.56,28.06 SV3.6
ADC4
  Bottom 0.2: DD1.18 16.58,21.5 arc-45 16.32,21.54 14.54,23.42 arc-45 14.8,23.41 arc90 14.2,23.5 11.58,23.5 arc-45 11.02,23.73 7.98,26.77 arc-45 7.75,27.33 7.75,29.7 arc90 6.95,30.5 3.5,30.5 3.4,30.6 SV3.7
BUZZER
  Bottom 0.2: R23.1 45.63,37.73 SV2.5
CS  (via drill 0.7)
  Top 0.2: DD4.8 19.5,33.05 arc-90 18.7,32.25 16.27,32.25 arc37 15.79,32.09 v15,31.5 R12.2
  Bottom 0.2: DD1.29 21.25,27.55 arc46 21.01,28.13 20.61,28.52 arc44 20.05,28.75 16.08,28.75 arc-45 15.52,28.98 15.23,29.27 arc-45 15,29.83 v15,31.5
CS_FLASH  (via drill 0.6)
  Top 0.2: 35,37.18 43,37.18 R10.2 | 45.25,35.25 45.25,35 v46.5,33.75
  Top 0.254: DD6.1 35,38.65 35,37.18 | 43,37.18 45.24,37.18 45.25,35.25
  Bottom 0.2: v46.5,33.75 45.25,32.5 42,32.5 42,26.25 36.76,21 34.76,21 34.75,21 34.75,20.5 DD1.60
ECHO
  Bottom 0.2: X4.2 12,5.17 12,6.17 arc45 11.77,6.73 10.23,8.27 arc45 9.67,8.5 9.05,8.5 arc-90 8.25,9.3 8.25,10.17 arc-45 8.48,10.73 9.02,11.27 arc-45 9.58,11.5 13.67,11.5 arc45 14.23,11.73 16.77,14.27 arc-45 17.34,14.51 DD1.4
GND  (via drill 0.7)
  Top 0.2: C17.2 22.5,32.37 22.5,33.25 21,33.25 DD4.11 21,35 21.5,35 21.5,37.5 DD4.18 | DD4.18 DD4.1 | DD4.18 23.5,37.5 | 23.5,37.5 23.62,37.38 C15.2 24.75,36.62 24.75,36.5 27.25,36.5 28.5,35.25 28.5,34.4 DD2.9 29.15,34.37 29.75,34.37 29.75,34.25 29.75,33.4 DD2.11 28.5,33.39 28.5,33.25 27.5,33.25 27.5,32.62 C10.2 | C16.2 23.75,40 23.75,39.5 | 23.75,39.5 23.75,38 23.5,37.75 23.5,37.5 | DD5.2 DD5.3 36.36,32.39 36.25,32.5 35.01,32.5 C9.2 | C14.2 29.62,39.13 29.25,39.5 23.75,39.5 | C2.2 22.23,18.5 27,18.5 | R22.1 4,38.5 4,37 3.98,36.98 | 3.98,36.98 BATERY.1 | C8.2 C19.2 4.12,36.98 3.98,36.98 | 16.5,0.75 14.5,0.75 LED3.C
  Top 0.3: C5.2 27.12,24.87 26.75,24.5 26.75,22.75 | 26.75,22.75 28.04,22.75 DA1.2 26.76,22.74 26.75,22.75 | 26.75,22.75 26.75,19.75 27,19.75 | 27,19.75 C13.- 27,19.75 | 27,19.75 27,18.5 27,17.63 C1.2 27.13,17.13 26.75,16.75 26.75,15 | 26.75,15 DA2.2 26.75,15 | 26.75,15 26.75,13 27,13 28.25,11.75 28.25,10.78 C3.- | C7.2 29.34,11.87 C3.- | C3.- 28.22,8.6 C6.2 | DD4.1 16.5,37.5 v16.25,37.25 | C2.2 21.31,17.14 arc45 21.88,17.38 22.02,17.52 arc45 22.25,18.08 22.25,21 22,21.25 | 17.25,21.25 v14,18
  Bottom 0.2: DD1.10 | 12.25,17.5 12.25,17.75 12,17.75 ZQ1.2 | X3.1 42.5,4.82 42.5,3.25 | DD1.74 34.5,13.5 34.5,11.5 35.5,11.5 C26.2 | v29.75,9.5 29.63,9.75 30.25,9.13 30.81,9.13 arc-90 30.85,9.08 30.94,9 31,9 31.09,8.91 32.25,8.91 32.75,8.66 | SV1.1 43.04,50.96 42.25,51.75 33.96,51.75 M1.3 | 31.92,8.91 32.75,8.66 | 32.75,8.66 34.76,8.66 arc-45 35.07,8.43
  Bottom 0.3: DD1.99 20.25,17.5 20,17.5 | 20,17.5 DD1.10 | DD1.20 20,22.5 | 20,22.5 20.25,22.25 20.25,17.75 20,17.5 | DD1.10 14.5,17.5 14.23,17.23 arc-45 13.67,17 13.08,17 arc-45 12.52,17.23 12.25,17.5 | 20,22.5 20.25,22.5 DD1.27 20.25,25 20.5,24.75 25,24.75 25.25,25 DD1.37 | 35.07,8.43 v37.5,5.75
  Bottom 0.406: 42.25,3.75 42.13,3.71 | 51,26 50.97,25.95
  Bottom 1: 8.25,50.5 32.75,50.5 32.75,51.5 | 32.75,51.5 7,51.5 | 32.75,51.5 36.75,51.5 | 50.5,29.5 50.5,21.5
  other vias: 37,11.25 5,22.5 36.25,33.5 36.25,29 8.5,6.5 1.25,7 44.75,42.5 31,41.25 15.25,41.75 1.5,44 46.25,51 45.25,6.5 12,15.75 40.25,38.5 40.5,43 50.5,32.5 14.25,14 9.5,20 4.75,32 11.25,33.5 29.75,18 29.75,22.75 22,20.25 23,17 5.75,9.75 36,26
  pour Top (isolate 0.3): 0,49.5 0,2.5 arc90 2.5,0 49.5,0 49.75,0 arc90 52,2.25 52,49.5 arc90 49.5,52 2.5,52 arc90
  pour Bottom (isolate 0.3): 0,49.5 0,2.5 arc90 2.5,0 49.5,0 49.75,0 arc90 52,2.25 52,49.5 arc90 49.5,52 2.5,52 arc90
GPIO2
  Bottom 0.2: DD1.8 15.58,16.5 arc45 15.02,16.27 11.48,12.73 arc-45 10.92,12.5 4.83,12.5 arc-45 4.27,12.73 4.23,12.77 arc-45 4,13.33 4,17.32 arc69 3.6,17.9 SV3.2
GPIO3
  Bottom 0.2: DD1.9 15.08,17 arc45 14.52,16.77 11.73,13.98 arc-45 11.17,13.75 5.3,13.75 arc-90 4.5,14.55 4.5,17.67 arc45 4.27,18.23 2.06,20.44 SV3.3
GPS_RX
  Bottom 0.2: DD1.56 36.76,22.5 40.5,26.25 40.5,34.5 44,34.5 44,40.25 47.96,40.25 SV2.3
GPS_TX
  Bottom 0.2: DD1.55 36.76,23 40,26.25 40,35 43.5,35 43.5,41.25 45,41.25 46.5,42.75 47.92,42.75 SV2.1
INT_MAG  (via drill 0.7)
  Top 0.2: v25.25,28.25 25.77,29.11 arc-59 26.45,29.5 29.95,29.5 arc90 30.75,30.3 DD2.15
  Bottom 0.2: DD1.36 24.75,27.75 arc-90 v25.25,28.25
INT_MPU  (via drill 0.7)
  Top 0.2: v23.75,30 23.75,33.42 arc45 23.52,33.98 arc45 23.23,34.1 DD4.12
  Bottom 0.2: DD1.35 24.25,27.75 23.98,28.02 arc-45 23.75,28.58 v23.75,30
MISO  (via drill 0.7)
  Top 0.2: v16.75,30.5 16.75,30.95 arc-90 17.55,31.75 19.2,31.75 arc90 20,32.55 DD4.9
  Bottom 0.2: DD1.31 22.25,28.17 arc45 22.02,28.73 21.48,29.27 arc45 20.92,29.5 17.55,29.5 arc-90 16.75,30.3 v16.75,30.5
MOSI  (via drill 0.7)
  Top 0.2: v15,34 15,38.17 arc-45 15.23,38.73 arc-45 15.27,38.75 18.5,38.75 18.85,38.4 DD4.24
  Bottom 0.2: DD1.32 22.75,28.41 arc46 22.51,28.98 21.79,29.69 arc44 21.23,29.91 18.55,29.91 arc-90 17.74,30.71 17.75,33.2 arc90 16.95,34 v15,34
MOTOR_1
  Bottom 0.2: DD1.45 29.25,27.75 29.25,28.25 23.75,33.75 23.75,42.75 24.25,43.25 30.54,43.25 M1.1
MOTOR_2
  Bottom 0.2: DD1.44 28.75,28 23.25,33.5 23.25,43.25 23.75,43.75 27.25,43.75 28.5,45 28.79,45 M2.1
MOTOR_3
  Bottom 0.2: M3.1 24.54,44.25 23.5,44.25 22.75,43.5 22.75,33.25 27.75,28.25 27.75,28 DD1.42
MOTOR_4
  Bottom 0.2: DD1.40 26.75,28 26.75,28.5 22.25,33 M4.1
MOTOR_5
  Bottom 0.2: DD1.26 19.75,27.5 11.33,27.5 arc-45 10.77,27.73 9.98,28.52 arc-45 9.75,29.08 9.75,42.2 arc-90 10.55,43 13.42,43 arc45 13.98,43.23 14.52,43.77 arc-45 15.08,44 16.67,44 arc45 17.23,44.23 18.46,45.46 M5.1
MOTOR_6
  Bottom 0.2: DD1.25 18.02,25.5 12.58,25.5 arc-45 11.02,26.23 9.48,27.77 arc-45 9.25,28.33 9.25,42.7 arc-90 10.05,43.5 13.17,43.5 arc45 13.73,43.73 15.25,45.25 M6.1
MOTOR_7
  Bottom 0.2: DD1.24 17.25,24.5 arc-90 17,24.75 15.25,24.75 arc90 15,24.5 12.08,24.5 arc-45 11.52,24.73 8.98,27.27 arc-45 8.75,27.83 8.75,43.2 arc-90 9.55,44 11.75,44 arc135 11.75,44 M7.1
MOTOR_8
  Bottom 0.2: DD1.23 17,24 arc-90 16.75,24.25 15.75,24.25 arc90 15.5,24 11.83,24 arc-45 11.27,24.23 8.48,27.02 arc-45 8.25,27.58 M8.1
N$1
  Bottom 0.2: DD1.13 16.33,19 arc-45 15.77,19.23 14.23,20.77 arc45 13.67,21 7.5,21 7.5,20.01 ZQ1.1
N$2
  Bottom 0.2: R15.2 10.5,16.4 10.5,15.25 arc135 10.49,15.26 ZQ1.3
N$3  (via drill 0.7)
  Top 0.2: RN3.5 12.73,6.14 arc-39 12.95,6.63 13.98,7.75 arc-47 14.56,8 15.55,8 arc-90 16,7.55 arc90 16.8,6.75 18.5,6.75 v19,6.5
  Bottom 0.2: v19,6.5 19.08,6.84 19.08,7.38 arc-33 19.21,7.82 20.28,9.44 arc27 21.08,9.88 21.21,10.13 arc18 21.25,10.38 DD1.97
N$4
  Top 0.3: DA2.4 25.45,17.42 C1.1
N$5  (via drill 0.7)
  Top 0.2: RN3.6 12,5.72 12,6.17 arc-45 12.23,6.73 13.77,8.27 arc-45 14.33,8.5 17.25,8.5 arc-90 v18,7.75
  Bottom 0.2: 18.13,7.88 v18,7.75 arc-35 18.35,8.48 arc33 19.79,9.76 arc-30 20.56,10.01 arc65 20.72,10.2 20.67,10.13 arc-90 20.7,10.16 20.66,10.08 arc27 20.75,10.44 DD1.98
N$6
  Top 0.2: R6.2 | R6.2 LED3.A
N$7
  Top 0.2: 25.27,9.11 25.27,6.32 arc-90 24.48,5.52 16.25,5.5 16.25,5.75 | 16.25,5.75 | 16.25,5.75 R6.1
  Top 0.3: C6.1 25.27,9.11 C3.+ 25.46,10.94 DA2.5 22.27,14.01 C2.1 | 19.5,15.5 19.5,20.25 20.75,21.5 21.5,21.5 R24.1
  Top 0.4: 19.5,15.5 20.88,15.5 C2.1
N$8
  Bottom 0.2: RN1.1 24.08,4.75 24.25,4.75 RADIO_IN.5
N$9
  Top 0.3: R16.1 29.85,15.9 29.75,16 | 29.75,16 DA2.3 29.75,16 | 29.75,16 C7.1 | C7.1 | C7.1 28.44,13.62 DA2.1
N$10  (via drill 0.7)
  Top 0.2: v15.5,9.5 14.58,9.5 arc45 14.02,9.27 11.33,6.58 arc45 11.1,6.02 RN3.7
  Bottom 0.2: DD1.1 15.73,10.71 arc45 15.5,10.14 v15.5,9.5
N$11  (via drill 0.7)
  Top 0.2: v12.49,9.27 10.53,7.78 arc44 10.3,7.22 RN3.8
  Bottom 0.2: DD1.2 17.08,13.5 arc45 16.52,13.27 12.5,9.25 v12.49,9.27
N$12
  Bottom 0.2: DD1.12 16.08,18.5 arc-45 15.52,18.73 14.23,20.02 arc45 13.67,20.25 11.3,20.25 arc90 10.5,19.45 10.5,18.1 R15.1 10.5,18.25 10.75,18.5
N$13
  Top 0.2: R20.2 14.5,2.9 LED1.A
N$14
  Bottom 0.2: 33.5,14.5 36.25,14.5 36.75,14 36.75,13.5 37.5,12.75
N$16
  Top 0.2: RN3.4 12.75,4.33 12.75,3.75 13,3.5 LED2.A
N$17
  Top 0.2: RN3.3 11.75,4.22 11.75,3.75 11.75,3.5 LED4.A
N$18
  Bottom 0.2: 31.75,11.25 32.25,10.75 32.25,9.75 32.75,9.25 35.25,9.25 36.5,8 37.75,8 38.5,8.75 38.5,9.25 39,9.75
N$19
  Top 0.2: DD4.20 21,40 20.88,40.12 C16.1
N$20
  Top 0.3: SV5.3 48,21.75 | 48,23 41.75,23 41.35,22.6 D1.1 D1.2 | 49.48,31 50.86,31 arc90 51.66,31.8 51.66,44.2 arc90 50.86,45 46.58,45 | 45,46.25 45,50.82 arc90 44.2,51.62 36.49,51.62 arc44 35.94,51.41 35.25,50.75
  Top 0.4: SV4.4 49.48,31 | 46.58,45 arc-45 46.02,45.23 45,46.25 | 35.25,50.75 35.25,48 M1.2
  Top 0.406: 22,48 M4.2
  Top 0.6: 48,21.75 48,23 SV5.4 SV4.3 SV4.4
  Top 1: M8.2 22,48 M1.2
  Bottom 0.6: M8.2 M7.2 M6.2 M5.2 M4.2 M3.2 M2.2 | M2.2 | M2.2 M1.2
  Bottom 1: 48,29.5 SV4.3 48,21.75
N$21
  Bottom 0.2: RN2.4 25.5,5.88 25.5,4.25 25.73,4.02 RADIO_IN.3
N$22
  Top 0.2: DD4.10 20.5,32.75 20.87,32.38 C17.1
N$23
  Bottom 0.2: RN1.4 19.17,4.5 RADIO_IN.9
N$24
  Bottom 0.2: RN1.3 21.25,5.78 21.25,4.25 21.48,4.02 RADIO_IN.7
N$25
  Top 0.2: R21.1 | R21.1 1.75,40.25 1.75,40.24 BATERY.2
N$26
  Top 0.2: DD2.10 28,33.9 28,34.25 27,34.25 C10.1
N$27
  Top 0.2: C11.2 25.5,32.55 arc90 26.3,31.75 28.5,31.75 28.5,32.75 29.15,32.75 DD2.12
N$28
  Top 0.2: C11.1 27.43,37.37 DD2.8
N$29
  Bottom 0.2: DD1.58 36.74,21.5 36.75,21.5 41.5,26.25 41.5,33.5 45.25,33.5 45.25,35.4 R23.2
N$32
  Bottom 0.2: RN1.2 22.25,5.78 22.25,5.25 23,4.5 23,2.75 24.25,1.5 RADIO_IN.6
N$33
  Bottom 0.2: RN2.2 28.15,5.23 29.33,5.23 29.33,5.08 RADIO_IN.1
N$34
  Bottom 0.2: RN2.3 27.35,5.42 27.5,5.25 28,4.75 28,2.75 26.79,1.54 RADIO_IN.4
N$35
  Bottom 0.2: RN2.1 28.82,5.75 30.5,5.75 30.5,3 29.33,1.83 RADIO_IN.2
N$38
  Top 0.2: RN3.2 11,4.28 11,3.75 10.5,3.25 | 10.5,3.25 | 10.5,3.25 LED5.A
N$39
  Top 0.2: RN3.1 9.68,3.75 9.5,3.75 9.25,3.5 LED6.A
N$41  (via drill 0.7)
  Top 0.2: v38,14.5 38,13.3 38.3,13 38.3,12.5 38.75,12.5 39.25,12.5 R1.1
  Bottom 0.2: DD1.70 35.75,15.5 35.75,16 37,16 38.25,17.25 39.5,17.25 39.5,15.75 38,14.25 v38,14.5
N$42  (via drill 0.7)
  Top 0.2: v38.5,16 39.5,15 39.66,15 R2.1
  Top 0.406: R3.2 39.75,15.25 39.75,15 39.66,15
  Bottom 0.2: DD1.71 36.01,15.01 36.5,15.5 38,15.5 v38.5,16
N$43
  Top 0.2: USB.2 44.5,12.75 42,12.75 41.75,12.5 R1.2
N$44
  Top 0.2: USB.3 44.45,13.5 42,13.5 41.5,14 R2.2
N$45  (via drill 0.7)
  Top 0.2: R4.2 41,8.88 R5.2 40.87,7.75 38.33,7.75 arc-45 37.77,7.98 37,8.75 v37,9
  Bottom 0.2: v37,9 arc90 36.25,9.75 33.55,9.75 arc-90 32.75,10.55 32.75,11.67 arc45 32.52,12.23 32.23,12.52 arc45 31.67,12.75 27.25,12.75 DD1.85
N$47
  Top 0.3: USB.1 44.55,12 43.08,12 arc45 42.52,11.77 42.33,11.58 arc45 42.25,11.39 arc-90 41.45,10.59 R4.1 40.5,11.08 40.5,16.75 41.35,17.6 D3.1 D3.2
N$52
  Top 0.3: DA1.4 25.45,25.42 C5.1
N$53
  Bottom 0.2: DD1.49 31.25,27.25 arc-90 32,28 C4.1
N$61  (via drill 0.7)
  Top 0.2: JP2.1 4.64,12.02 R8.1 4.75,11.5 5.25,11 9.5,11 v9.5,10.25 | v22.5,8.75 19.83,8.75 arc-45 19.27,8.98 v18.5,9.75
  Bottom 0.2: DD1.94 22.75,9 22.25,9 v22.5,8.75 | v18.5,9.75 17.4,8.73 arc60 17,8.04 17,5.8 arc-90 16.2,5 15.08,5 arc-45 14.52,5.23 12.87,6.88 arc45 12.58,7 arc-45 12.02,7.23 9.5,9.75 v9.5,10.25
N$66  (via drill 0.7)
  Top 0.2: v6.75,23.75 6.75,28.88 C25.1 7.4,29.5 R9.2
  Bottom 0.2: DD1.14 16.58,19.5 arc-45 15.8,19.77 14.27,21.29 arc45 13.92,21.5 9.33,21.5 arc-45 8.77,21.73 v6.75,23.75
N$77
  Bottom 0.2: DD1.73 35,14 C26.1
P_RX
  Bottom 0.2: DD1.69 35.24,16 35.25,16 35.25,16.5 36.75,16.5 40.75,20.5 43.75,20.5 44.75,19.5 44.75,10 40.5,5.75 40.5,4.86 X3.3
P_TX
  Bottom 0.2: X3.2 41.5,4.86 41.5,6 45.25,9.75 45.25,16.49 | 45.25,16.49 arc45 45.24,16.5 | DD1.68 34.74,16.5 34.75,16.5 34.75,17 36.5,17 40.5,21 43.75,21 45.25,19.5 45.25,16.49
PPS
  Bottom 0.2: DD1.57 36.74,22 36.75,22 41,26.25 41,34 44.5,34 44.5,39 49.25,39 SV2.4
RADIO_1  (via drill 0.7)
  Top 0.2: v31.25,9.87 31.25,7.25 31.38,7.38 v30.95,7.12
  Bottom 0.2: DD1.77 v31.25,9.87 | v30.95,7.12 RN2.8
RADIO_2
  Bottom 0.2: DD1.89 25.25,9.05 arc90 26.05,8.25 28,8.24 arc-82 28.15,8.1 RN2.7
RADIO_3
  Bottom 0.2: DD1.90 24.75,8.55 arc90 25.55,7.75 26.67,7.75 arc-45 27.23,7.52 27.35,7.4 RN2.6
RADIO_4
  Bottom 0.2: DD1.91 24.25,11.03 24.26,7.48 arc91 24.62,7.12 RN2.5
RADIO_5
  Bottom 0.2: DD1.92 23.75,9.75 23.75,7.91 arc-91 RN1.8
RADIO_6
  Bottom 0.2: DD1.93 23.25,10.25 arc2 23.25,10.25 23.25,9.5 | RN1.7 22.15,7.85 22.6,7.85 arc90 23.38,8.79 arc20 23.25,9.5 | 23.25,9.5 arc90 23.25,9.5
RADIO_7
  Bottom 0.2: DD1.95 22.23,10.17 arc-45 21.83,9.48 21.42,8.96 arc45 21.1,7.52 RN1.6
RADIO_8
  Bottom 0.2: DD1.96 21.75,10.08 arc-45 21.28,9.42 20.32,8.75 arc45 19.95,7.13 RN1.5
SCK  (via drill 0.7)
  Top 0.2: v17.25,40.25 18.7,40.25 arc-90 19.5,39.45 DD4.23
  Bottom 0.2: DD1.30 21.75,27.67 arc45 21.52,28.23 20.64,29.11 20.61,29.11 arc45 20.53,29.15 16.29,29.15 arc-45 15.74,29.38 arc-25 15.5,29.75 arc-39 15.5,30.25 arc-14 15.75,30.75 arc14 16.25,31.75 arc92 15.88,32.74 arc15 15.81,32.75 14.71,32.75 14.66,32.75 13.75,32.75 13.75,39.45 arc-90 14.55,40.25 v17.25,40.25
SCL  (via drill 0.7)
  Top 0.2: DD2.1 32.99,32.9 33,32.91 33,36 v34.25,36 40.5,36 40.5,34.89 DD5.8
  Bottom 0.2: DD1.47 30.25,29.92 arc-45 30.48,30.48 31.14,31.14 DD3.6 31.14,33.72 arc-45 31.25,34 31.92,34 arc45 32.48,34.23 33.25,35 | 33.25,35 v34.25,36 | R7.1 33.65,34.27 arc45 33.42,34.83 33.25,35
SDA  (via drill 0.7)
  Top 0.2: DD2.16 31.25,31.75 31.75,31.25 v31.75,29.25 arc90 32.5,28.5 34.42,28.5 arc-45 34.98,28.27 35.52,27.73 arc45 36.08,27.5 38.92,27.5 arc45 39.48,27.73 41.77,30.02 arc45 42,30.58 42,33.25 41.61,33.64 DD5.7
  Bottom 0.2: DD1.48 30.75,29.67 arc-45 30.98,30.23 31.75,31 | 31.75,31 32.25,31 32.41,31.16 | 32.41,31.16 DD3.5 | 31.75,31 v31.75,29.25 | R14.1 32.81,30.75 32.41,31.16
SERVO_1
  Bottom 0.2: DD1.63 36.26,19 43.5,26.25 43.5,29.25 43.75,29.5 45.44,29.5 SV4.6
SERVO_2
  Bottom 0.2: DD1.64 36.26,18.5 44.75,27 45.44,27 SV4.5
SERVO_3
  Bottom 0.2: DD1.65 36.24,18 36.25,18 42.5,24.25 45.44,24.25 SV5.6
SERVO_4
  Bottom 0.2: DD1.66 36.24,17.5 36.25,17.5 40.5,21.75 45.44,21.75 SV5.5
SPI2_CS
  Bottom 0.2: DD1.51 36.76,25 38,26.25 38,37 41.5,37 41.5,45.25 40.75,46 37.5,46 36.5,47 36.5,49.25 39.23,49.25 SV1.3
SPI2_MISO
  Top 0.2: DD6.2 36.37,40.63 36.25,40.75 33.75,40.75 33.5,41 33.5,43.75 34.5,44.75 34.5,45 36.25,46.75 36.25,48.75 36.75,49.25 39.23,49.25 SV1.4
  Bottom 0.2: DD1.53 36.76,24 39,26.25 39,36 42.5,36 42.5,46 41.5,47 41.48,47 SV1.4
SPI2_MOSI
  Top 0.2: DD6.5 38.91,45.16 39.5,45.75 41.25,45.75 42.5,47 42.5,47.44 SV1.2
  Bottom 0.2: DD1.54 36.76,23.5 39.5,26.25 39.5,35.5 43,35.5 43,47.94 SV1.2
SPI2_SCK
  Top 0.2: DD6.6 37.63,47.66 SV1.6
  Bottom 0.2: DD1.52 36.76,24.5 38.5,26.25 38.5,36.5 42,36.5 42,45.5 40.75,46.75 38,46.75 38,47.94 SV1.6
TEL_RX
  Bottom 0.2: DD1.87 26.25,9.42 arc90 27.05,8.62 27.93,8.62 arc-59 28.61,8.23 arc59 29.02,8 31.75,8 32.25,7.5 33.25,7.5 33.5,7.25 33.5,4.91 X2.3
TEL_TX
  Bottom 0.2: DD1.86 26.75,9.88 arc90 27.55,9.08 28.47,9.08 arc-60 28.77,8.9 arc60 29.47,8.5 32.01,8.5 32.01,8.49 32.5,8 33.67,8 34.57,7.1 X2.2
TRIGGER
  Bottom 0.2: X4.3 11,5.17 11,5.92 arc45 10.77,6.48 9.48,7.77 arc45 8.92,8 8.3,8 arc-90 7.5,8.8 7.5,10.42 arc-45 7.73,10.98 8.52,11.77 arc-45 9.08,12 13.42,12 arc45 13.98,12.23 16.57,14.82 arc-45 17,15 17,15.01 DD1.5
V+  (via drill 0.7)
  Top 0.2: DD4.13 24,35 C15.1 | DD2.2 31.1,33.4 31,33.5 31,34.25 31.02,34.25 31.13,34.36 | 31.13,34.36 | 31.13,34.36 31.16,34.4 DD2.4 32,34.55 32,36.75 | C14.1 31.37,37.38 32,36.75 | 22.25,27 31.97,27 arc39 32.47,27.18 33.28,27.82 arc-39 33.78,28 34.17,28 arc-45 34.73,27.77 35.27,27.23 arc45 35.83,27 42.2,27 arc90 43,27.8 43,36.75 32,36.75
  Top 0.3: v18.5,26.25 18.5,26.75 18.52,26.77 arc-45 19.08,27 22.25,27 24.77,29.52 arc45 25,30.08 25,32.92 arc45 24.77,33.48 24.23,34.02 arc-45 24,34.58 24,35 | R24.2 19.5,24.1
  Top 0.4: 19.5,24.1 19.5,24.92 arc45 19.27,25.48 v18.5,26.25
  Bottom 0.3: DD1.21 DD1.22 19.25,23.5 19.27,23.52 arc45 19.5,24.08 19.5,25.25 v18.5,26.25
V_BAT  (via drill 0.7)
  Top 0.2: v18.75,30.75 18.75,29.25 14,29.25 13.75,29.5 13.75,30.5 13,30.5 13,33.5 12.25,34.25 12.25,38.5 12.11,38.64 R22.2 R21.2
  Bottom 0.2: DD1.33 23.25,28.67 arc45 23.02,29.23 21.73,30.52 arc45 21.17,30.75 v18.75,30.75
VCC  (via drill 0.7)
  Top 0.2: DD2.13 29.75,31.25 v29,30.5 | 41.75,15.5 41.36,15.5 R3.1 | v33.75,26.5 24.33,26.5 arc45 23.77,26.27 23.23,25.73 arc45 23,25.17 23,23.25 | DD5.5 DD5.4 | DD5.4 39.14,31.14 39.5,31.25 39.5,34.75 38.14,34.75 DD5.1 35.52,34.89 C9.1 | DD5.4 37.25,31.25 v36.75,31.25 | R12.1 9.1,31.49 R9.1 8.75,31.75 8.75,33.25 5.88,33.25 C8.1 C19.1 | 14.75,23.25 13.75,23.25 C18.1 | DD6.8 DD6.7 36.25,43.73 36.25,42 37.63,40.62 DD6.3 37.63,40.63 38.25,41.25 v40,41.25 42.5,41.25 43,40.75 R10.1 | 3.52,8.47 2.5,9.25 1.96,9.25 JP2.2
  Top 0.3: C13.+ 24.77,21.06 | 24.77,21.06 DA1.5 | v14.5,7 14.25,6.5 14.25,5.6 R20.1 | 12.14,23.24 14.75,23.25 v16.25,23.25 23,23.25 arc-45 23.43,23.07 23.77,22.73 arc-45 24,22.17 24,21.83 24.77,21.06 | 12.14,23.24 12.25,21.78 arc-4 12.25,21.72 v12.25,19.25 12.25,17.92 arc-90 11.58,17.25 arc45 11.02,17.02 10.48,16.48 arc45 10.25,15.92 10.25,14.83 arc45 10.48,14.27 11,13.75 11.25,13.75 | 11.25,13.75 11.25,10.83 arc-45 11.02,10.02 9.71,8.71 arc-45 8.89,8.47 3.52,8.47 | v12.25,30 12.25,31.38 R12.1 12.15,23.6 12.14,23.24 | v15.75,15.5 14.08,15.5 arc45 13.52,15.27 12.23,13.98 arc-45 11.67,13.75 11.25,13.75 | 41.75,15.5 41.75,16.5 v42,16.75
  Bottom 0.2: DD3.7 DD3.8 29,31.75 v29,30.5 29,31.75 28.75,32 28.75,34.67 arc-45 28.98,35.23 29.02,35.27 arc-45 29.58,35.5 32.58,35.5 arc90 33.25,36.17 arc-45 33.48,36.73 33.52,36.77 arc-45 34.08,37 35,37 | v42,16.75 37.73,10.48 arc-45 37.17,10.25 35.5,10.25 34.29,10.25 arc-89 33.49,11.04 DD1.75 32.51,13.01 arc-90 32.49,13.01 31.98,13.52 arc-45 31.75,14.08 DD1.50 33.52,26.73 | 33.52,26.73 v33.75,26.5 | 36.75,30.75 37.27,30.23 arc-45 37.5,29.67 37.5,27.75 37,27.25 35.75,27.25 35.23,26.73 33.52,26.73 | 36.75,30.75 R14.2 | R14.2 | R14.2 R7.2 35.25,32.35 35.25,37 35,37 | v36.75,31.25 36.75,30.75 | v40,41.25 39.25,41.25 35,37 | v14.5,7 17.47,10.22 arc-6 17.53,10.28 19.75,12.25
  Bottom 0.3: DD1.100 19.75,12.25 19.75,15.25 19.5,15.5 DD1.6 16.75,15.51 16.75,15.5 v15.75,15.5 | DD1.19 16.83,22 arc-45 16.32,22.34 v16.25,23.25 | DD1.28 20.75,27.42 arc45 20.51,27.99 20.48,28.02 arc45 19.92,28.25 14.33,28.25 arc-45 13.77,28.48 v12.25,30 | DD1.11 15.26,18 arc45 15.25,18 arc45 15.07,18.43 14.23,19.27 arc45 13.67,19.5 12.5,19.5 v12.25,19.25
XZ3
  Top 0.254: 47.98,35.25 SV2.7
  Bottom 0.2: DD1.61 35.24,20 35.25,20 35.25,20.5 36.75,20.5 42.5,26.25 42.5,32 46.5,32 48,33.5 48,35.17 SV2.7
XZ4
  Bottom 0.2: DD1.62 35.74,19.5 35.75,19.5 35.75,20 36.75,20 43,26.25 43,31.5 46.75,31.5 49.25,34 49.33,34 SV2.8
(copper drawn outside any net)
  shapes: Bottom circle x2